# Altium schematic sheet POWER SUPPLY.SchDoc
size A4
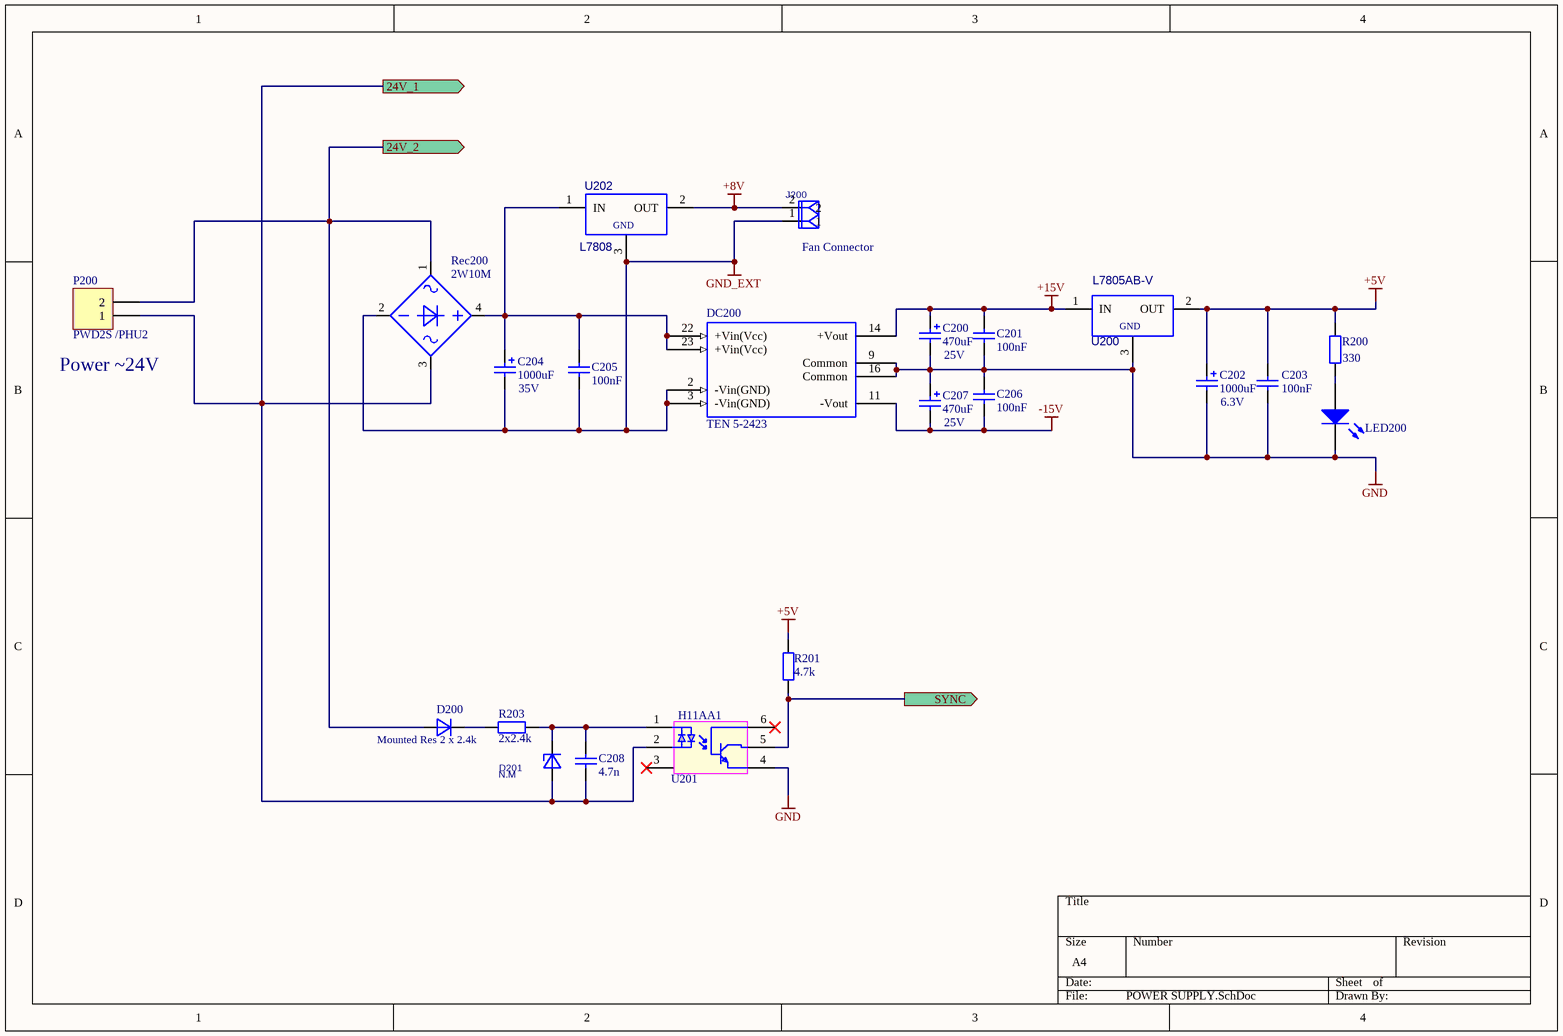
[diagram p0: POWER SUPPLY.SchDoc]

## Parts
C200  value 470uF  Voltage: 25V  [Cap Electrolyt 7]  (hidden comment: Cap)
C201  value 100nF  [3216[1206]]  (hidden comment: Cap 1206)
C202  value 1000uF  Voltage: 6.3V  [Cap Electrolyt 7]  (hidden comment: Cap)
C203  value 100nF  [3216[1206]]  (hidden comment: Cap 1206)
C204  value 1000uF  Voltage: 35V  [Cap Electrolyt 7]  (hidden comment: Cap)
C205  value 100nF  [3216[1206]]  (hidden comment: Cap 1206)
C206  value 100nF  [3216[1206]]  (hidden comment: Cap 1206)
C207  value 470uF  Voltage: 25V  [Cap Electrolyt 7]  (hidden comment: Cap)
C208  value 4.7n  [3216[1206]]  (hidden comment: Cap 1206)
D200  value Mounted Res 2 x 2.4k  [D_MINIMELF_LL4148]  (hidden comment: LL4148)
D201  value N.M  [D_MINIMELF_BZV55C5V1(Primary)]  (hidden comment: BZV55C5V1)
DC200  TEN 5-2423  [DIP24_TRACO]
J200  SIP2  [SIP2]  (value not drawn)
LED200  LED  [LED_1206]  (value not drawn)
P200  PWD2S /PHU2  [PWD2S /PHU2]
R200  value 330  [3216[1206]]  (hidden comment: RES)
R201  value 4.7k  [3216[1206]]  (hidden comment: RES)
R203  value 2x2.4k  [3216[1206]]  (hidden comment: RES)
Rec200  2W10M  [WOB_2WXX[X]M]
U200  value L7805AB-V  [SFM-T3/E10.4V_L7805AC-V(Primary)]  (hidden comment: L7805AC-V)
U201  H11AA1  [DIP6]
U202  value L7808  [SFM-T3/E10.4V_L7805AC-V(Primary)]  (hidden comment: L7805AC-V)

## Ports
24V_1 (out), 24V_2 (out), SYNC (out)

## Nets
+5V: C202.1 C203.2 R200.1 R201.1 U200.2(OUT)
+8V: J200.2 U202.2(OUT)
+15V: C200.1 C201.2 DC200.14(+Vout) U200.1(IN)
-15V: C206.1 C207.2 DC200.11(-Vout)
GND: C200.2 C201.1 C202.2 C203.1 C206.2 C207.1 DC200.9(Common) DC200.16(Common) LED200.K U200.3(GND) U201.4
GND_EXT: C204.2 C205.1 DC200.2(-Vin(GND)) DC200.3(-Vin(GND)) J200.1 Rec200.2(-) U202.3(GND)
24V_1: C208.1 D201.A P200.1 Rec200.3(AC2) U201.2 ; port 24V_1
24V_2: D200.A P200.2 Rec200.1(AC1) ; port 24V_2
SYNC: R201.2 U201.5 ; port SYNC
NetC204_1: C204.1 C205.2 DC200.22(+Vin(Vcc)) DC200.23(+Vin(Vcc)) Rec200.4(+) U202.1(IN)
NetC208_2: C208.2 D201.K R203.2 U201.1
NetD200_K: D200.K R203.1
NetLED200_A: LED200.A R200.2

Not connected (* = marked no-connect by the designer): U201 3* 6*

## Notes on the sheet
- (near J200) Fan Connector
- (near P200) Power |4V

## Library data of the parts
C200 C202 C204 C207 = Cap pol
D201 = BZV55C5V1: Voltage regulator diode; Manufacturer: Any; Group: Discrete; Subgroup1: Zener; Subgroup: Diode; Package: SOD80C; Mounting: SMD
LED200 = LED: Value: TBD
R200 R201 R203 = RES 1
Rec200 = 2W10M: Description: Rectifier; Value: 2W10M
U200 = L7805AC-V: Precision 1A Regulator; ComponentField6: Tab is connected to pin 3 (GND).; ComponentField7: Published 24-Aug-2001; OriginalName: L7805AB-V
U202 = L7805AC-V: Precision 1A Regulator; OriginalName: L7805AB-V; ComponentField6: Tab is connected to pin 3 (GND).; ComponentField7: Published 24-Aug-2001
DC200 = TEN 5-2423: Value: TEN 5-2423
J200 = SIP2: Value: *
P200 = PWD2S /PHU2: Value: PWD2S /PHU2
U201 = H11AA1: Value: H11AA1